# Altium schematic sheet 1_P1.schdoc
size 307 x 264 mm; Symbol: Drawing-Symbol_A4; Device: Drawing-Symbol_A4; Company: 嘉立创EDA; Version: V1.0; Page Size: A4; @Project Name: 25国赛; @Page Count: 1; @Update Date: 2025-08-01; @Create Date: 2025-08-01; @Schematic Name: Schematic4; @Page No: 1; @Page Name: P1; @Create Time: 09:16:46; @Update Time: 18:01:17; Width: 1170; Height: 1000; Region Start: 1; X Region Count: 6; Y Region Count: 4; Blade Width: 10; Title Block Position: 3; @Board Name: HC4046
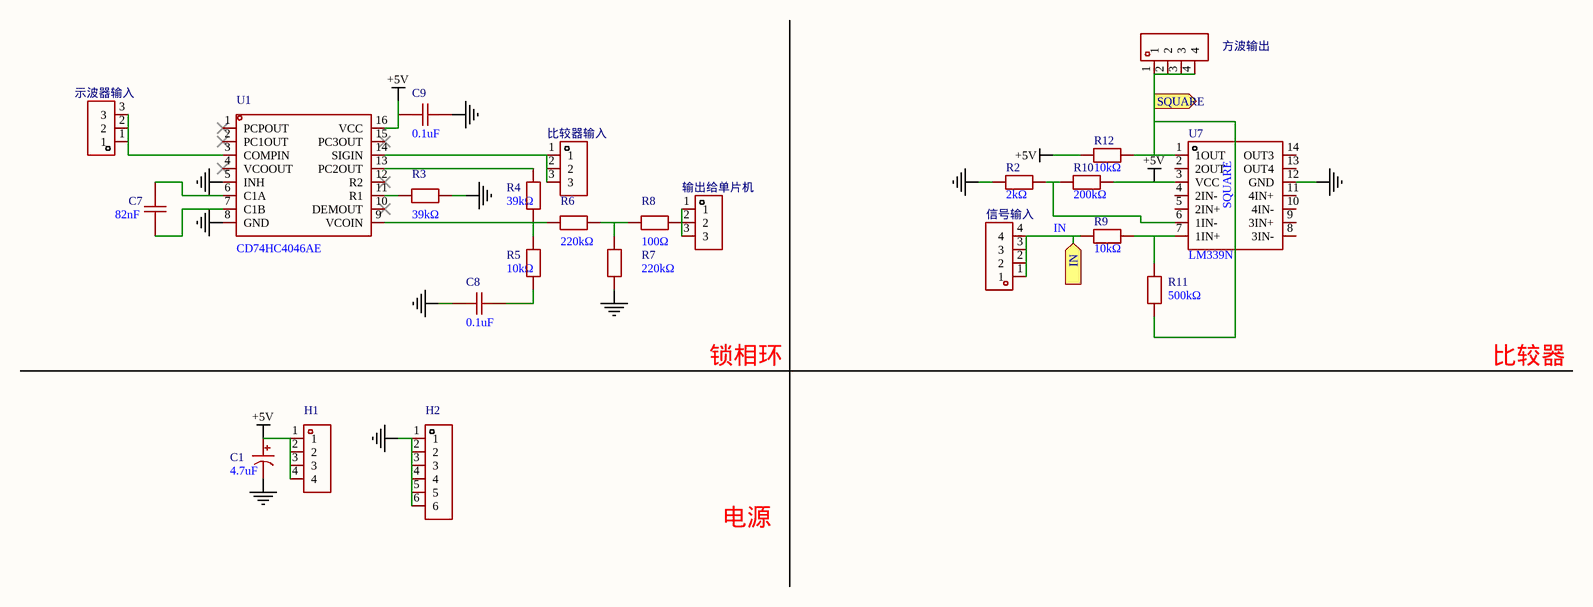
[diagram p0: 1_P1.schdoc]

## Parts
C1  4.7uF  [CAP-TH_BD8.0-P3.50-D0.8-FD]
C7  82nF  [CAP-TH_L8.0-W3.0-P5.0-D0.60]
C8  0.1uF  [CAP-TH_L8.0-W3.0-P5.0-D0.60]
C9  0.1uF  [CAP-TH_L8.0-W3.0-P5.0-D0.60]
H1  PZ254V-11-04P  [HDR-TH_4P-P2.54-V-M]  (value not drawn)
H2  PZ254V-11-06P  [HDR-TH_6P-P2.54-V-M]  (value not drawn)
R2  2kΩ  [RES-TH_BD2.7-L6.2-P10.20-D0.4]
R3  39kΩ  [RES-TH_BD2.7-L6.2-P10.20-D0.4]
R4  39kΩ  [RES-TH_BD2.7-L6.2-P10.20-D0.4]
R5  10kΩ  [RES-TH_BD2.7-L6.2-P10.20-D0.4]
R6  220kΩ  [RES-TH_BD2.7-L6.2-P10.20-D0.4]
R7  220kΩ  [RES-TH_BD2.7-L6.2-P10.20-D0.4]
R8  100Ω  [RES-TH_BD2.7-L6.2-P10.20-D0.4]
R9  10kΩ  [RES-TH_BD2.7-L6.2-P10.20-D0.4]
R10  200kΩ  [RES-TH_BD2.7-L6.2-P10.20-D0.4]
R11  500kΩ  [RES-TH_BD2.7-L6.2-P10.20-D0.4]
R12  10kΩ  [RES-TH_BD2.7-L6.2-P10.20-D0.4]
U1  CD74HC4046AE  [PDIP-16_L22.1-W6.3-P2.54-LS7.6-BL]
U7  LM339N  [DIP-14_L19.0-W7.0-P2.54-LS7.6-BL]
信号输入  PZ254V-11-04P  [HDR-TH_4P-P2.54-V-M]  (value not drawn)
方波输出  PZ254V-11-04P  [HDR-TH_4P-P2.54-V-M]  (value not drawn)
比较器输入  PZ254V-11-03P  [HDR-TH_3P-P2.54-V-M]  (value not drawn)
示波器输入  PZ254V-11-03P  [HDR-TH_3P-P2.54-V-M]  (value not drawn)
输出给单片机  PZ254V-11-03P  [HDR-TH_3P-P2.54-V-M]  (value not drawn)

## Ports
IN (in), SQUARE (out)

## Nets
+5V: C1.1 C9.1 H1.1 H1.2 H1.3 H1.4 R10.2 R12.1 U1.16(VCC) U7.3(VCC)
GND: C1.2 C8.1 C9.2 H2.1 H2.2 H2.3 H2.4 H2.5 H2.6 R2.1 R3.2 R7.1 U1.5(INH) U1.8(GND) U7.12(GND)
IN: R9.1 信号输入.1 信号输入.2 信号输入.3 信号输入.4 ; port IN
SQUARE: R11.1 R12.2 U7.1(1OUT) 方波输出.1 方波输出.2 方波输出.3 方波输出.4 ; port SQUARE
NetC7_1: C7.1 U1.6(C1A)
NetC7_2: C7.2 U1.7(C1B)
NetC8_2: C8.2 R5.1
NetR2_2: R2.2 R10.1 U7.6(1IN-)
NetR3_1: R3.1 U1.11(R1)
NetR4_1: R4.1 R5.2 R6.2 U1.9(VCOIN)
NetR4_2: R4.2 U1.13(PC2OUT)
NetR6_1: R6.1 R7.2 R8.2
NetR8_1: R8.1 输出给单片机.1 输出给单片机.2 输出给单片机.3
NetR9_2: R9.2 R11.2 U7.7(1IN+)
NetU1_3: U1.3(COMPIN) 示波器输入.1 示波器输入.2 示波器输入.3
NetU1_14: U1.14(SIGIN) 比较器输入.1 比较器输入.2 比较器输入.3

Not connected (* = marked no-connect by the designer): U1 1(PCPOUT)* 2(PC1OUT)* 4(VCOOUT)* 10(DEMOUT)* 12(R2)* 15(PC3OUT)*; U7 2(2OUT) 4(2IN-) 5(2IN+) 8(3IN-) 9(3IN+) 10(4IN-) 11(4IN+) 13(OUT4) 14(OUT3)

## Notes on the sheet
- 锁相环
- 比较器
- 电源
- 1
- 2
- 3
- 4
- 5
- 6
- A
- B
- C
- 原理图
- Schematic4
- 创建日期
- 更新日期
- 2025-08-01
- D
- 板子
- 绘制
- HC4046
- 图页
- P1
- 审阅
- 版本
- 尺寸
- 25国赛
- 页    1    共    1
- V1.0
- A4
- 嘉立创EDA

## Library data of the parts
C1 = ERS1HM4R7D11OT: Manufacturer: AISHI(艾华集团); Add into BOM: yes; Tolerance: ±20%; Rated Voltage: 50V; φD: 5mm; L: 11mm; Lifetime @ Temp: 5000hrs@105℃; Symbol: ERS1HM4R7D11OT; Device: ERS1HM4R7D11OT; Supplier: LCSC; Manufacturer Part: ERS1HM4R7D11OT; Value: 4.7uF; Supplier Part: C112512; JLCPCB Part Class: 扩展库; LCSC Part Name: 4.7uF ±20% 50V; Supplier Footprint: 插件,D5xL11mm; Datasheet: https://atta.szlcsc.com/upload/public/pdf/source/20191015/C438940_4B8E60A742BB0AE40DDEF87A5C89089D.pdf; Convert to PCB: yes; Lead Spacing: 2mm
C7-C9 = R08B1B102KN0B0S0N0: Manufacturer: STE(松田); Add into BOM: yes; Tolerance: ±10%; Voltage Rated: 2kV; Temperature Coefficient: Y5P; φD: 8mm; Body Thickness: 3mm; Symbol: R08B1B102KN0B0S0N0; Device: R08B1B102KN0B0S0N0; LCSC Part Name: 1nF ±10% 2kV; Manufacturer Part: R08B1B102KN0B0S0N0; Supplier Footprint: 插件,P=5mm; JLCPCB Part Class: 扩展库; Datasheet: https://atta.szlcsc.com/upload/public/pdf/source/20190806/C366874_7FA13009B587FE73099181E533DD7411.pdf; Supplier: LCSC; Convert to PCB: yes; Lead Spacing: 5mm
  C7: Value: 82nF
  C8 C9: Value: 0.1uF
H1 信号输入 方波输出 = PZ254V-11-04P: Manufacturer: XFCN(兴飞); Symbol: PZ254V-11-04P_C2691448; Add into BOM: yes; Pin Structure: 1x4P; Pitch: 2.54mm; Circluar Pins/Square Pins: 方针; Current Rating (Max): 3A; Voltage Rating (Max): 250V; Device: PZ254V-11-04P; LCSC Part Name: 间距:2.54mm 1x4P 直插 方针; Supplier Part: C2691448; Manufacturer Part: PZ254V-11-04P; Supplier Footprint: 插件,P=2.54mm; JLCPCB Part Class: 扩展库; Datasheet: https://atta.szlcsc.com/upload/public/pdf/source/20200309/C492403_F9F19131791D08044AD4F84F8E751A34.pdf; Supplier: LCSC; Convert to PCB: yes; Row Spacing: -; Mounting Type: 直插; Number of Rows: 单排; Number of Pins: 4P; Length of Mating Pin: 6mm; Insulation Height: 2.5mm; Length of End Connection Pin: 3mm; Contact Material: -; Operating Temperature Range: -40℃~+105℃; Color: 黑色
H2 = PZ254V-11-06P: Manufacturer: XFCN(兴飞); Add into BOM: yes; Pin Structure: 1x6P; Pitch: 2.54mm; Circluar Pins/Square Pins: 方针; Symbol: PZ254V-11-06P; Device: PZ254V-11-06P; LCSC Part Name: 1x6P 间距:2.54mm 方针 直插; Supplier Part: C492405; Manufacturer Part: PZ254V-11-06P; Supplier Footprint: 插件,P=2.54mm; JLCPCB Part Class: 扩展库; Datasheet: https://atta.szlcsc.com/upload/public/pdf/source/20200309/C492405_597F1930F5B55CC3C7FD95458F1C3977.pdf; Supplier: LCSC; Convert to PCB: yes; Row Spacing: -; Mounting Type: 直插; Number of Rows: 单排; Number of Pins: 6P; Current Rating: -; Voltage Rating (Max): -; Length of Mating Pin: 6mm; Insulation Height: 2.5mm; Length of End Connection Pin: 3mm; Contact Material: 黄铜; Contact Plating: -; Operating Temperature: -40℃~+105℃; Color: 黑色
R2 R9-R12 = MF1/4W-10K±1%-ST52: Manufacturer: VO(翔胜); Add into BOM: yes; Tolerance: ±1%; Overload Voltage (Max): 250V; Power(Watts): 250mW; Temperature Coefficient: ±100ppm/℃; Symbol: MF1/4W-10K±1%-ST52; Device: MF1/4W-10K±1%-ST52; LCSC Part Name: 金属膜电阻 10kΩ ±1% 250mW; Manufacturer Part: MF1/4W-10K±1%-ST52; Supplier Footprint: 插件,D2.7xL6.2mm; JLCPCB Part Class: 扩展库; Datasheet: https://atta.szlcsc.com/upload/public/pdf/source/20200609/C601728_5AA4C0C8E12E11069DA2C3356F29D1F2.pdf; Supplier: LCSC; Convert to PCB: yes; Type: 金属膜电阻; Operating Temperature Range: -55℃~+155℃
  R2: Value: 2kΩ
  R9 R12: Supplier Part: C2903232; Value: 10kΩ
  R10: Value: 200kΩ
  R11: Value: 500kΩ
R3-R8 = MF1/4W-1K±1%-ST52: Manufacturer: VO(翔胜); Add into BOM: yes; Tolerance: ±1%; Overload Voltage (Max): 250V; Power(Watts): 250mW; Temperature Coefficient: ±100ppm/℃; Symbol: MF1/4W-1K±1%-ST52; Device: MF1/4W-1K±1%-ST52; LCSC Part Name: 金属膜电阻 1kΩ ±1% 250mW; Manufacturer Part: MF1/4W-1K±1%-ST52; Supplier Footprint: 插件,D2.7xL6.2mm; JLCPCB Part Class: 扩展库; Datasheet: https://atta.szlcsc.com/upload/public/pdf/source/20200609/C601728_5AA4C0C8E12E11069DA2C3356F29D1F2.pdf; Supplier: LCSC; Convert to PCB: yes; Type: 金属膜电阻; Operating Temperature Range: -55℃~+155℃
  R3 R4: Value: 39kΩ
  R5: Value: 10kΩ
  R6 R7: Value: 220kΩ
  R8: Value: 100Ω
U1 = CD74HC4046AE: Manufacturer: TI(德州仪器); Add into BOM: yes; Output Frequency(Max): 38MHz; Voltage - Supply: 2V~6V; Number of Outputs: 3; Symbol: CD74HC4046AE; Device: CD74HC4046AE; LCSC Part Name: IC PLL W/VCO; Supplier Part: C354049; Manufacturer Part: CD74HC4046AE; Supplier Footprint: PDIP-16; JLCPCB Part Class: 扩展库; Datasheet: https://www.ti.com/cn/lit/gpn/cd74hc4046a; Supplier: LCSC; Convert to PCB: yes; Operating Temperature: -55℃~+125℃
U7 = LM339N: Manufacturer: HGSEMI(华冠); Symbol: LM339N_C725324; Add into BOM: yes; Number of Channels: 四路; Vos - Input Offset Voltage: 2mV; Ib - Input Bias Current: 25nA; Propagation Delay Time: 1.3us; Voltage - Supply: 2V~36V; Quiescent Current per Amplifier: 800uA; Device: LM339N; LCSC Part Name: 四通道差分比较器; Supplier Part: C725324; Manufacturer Part: LM339N; Supplier Footprint: DIP-14; JLCPCB Part Class: 扩展库; Datasheet: https://atta.szlcsc.com/upload/public/pdf/source/20200304/C492107_5AB4943D95DC1349E7CDE0A0D0CA3D46.pdf; Supplier: LCSC; Convert to PCB: yes; Common Mode Rejection Ratio(CMRR): -; Output Type: -; Operating Temperature: 0℃~+70℃
比较器输入 示波器输入 输出给单片机 = PZ254V-11-03P: Manufacturer: XFCN(兴飞); Symbol: PZ254V-11-03P_C2937625; Add into BOM: yes; Pin Structure: 1x3P; Pitch: 2.54mm; Circluar Pins/Square Pins: 方针; Current Rating (Max): 3A; Voltage Rating (Max): 250V; Device: PZ254V-11-03P; LCSC Part Name: 间距:2.54mm 1x3P 直插 方针; Supplier Part: C2937625; Manufacturer Part: PZ254V-11-03P; Supplier Footprint: 插件,P=2.54mm; JLCPCB Part Class: 扩展库; Datasheet: https://atta.szlcsc.com/upload/public/pdf/source/20200309/C492402_8335C3D49C4E4C618838D59BB1D024C1.pdf; Supplier: LCSC; Convert to PCB: yes; Row Spacing: -; Mounting Type: 直插; Number of Rows: 单排; Number of Pins: 3P; Length of Mating Pin: 6mm; Insulation Height: 2.5mm; Length of End Connection Pin: 3mm; Operating Temperature Range: -40℃~+105℃; Color: 黑色